# Altium schematic sheet I,O headers.SchDoc
size A4; SheetNumber: 4; SheetTotal: 4
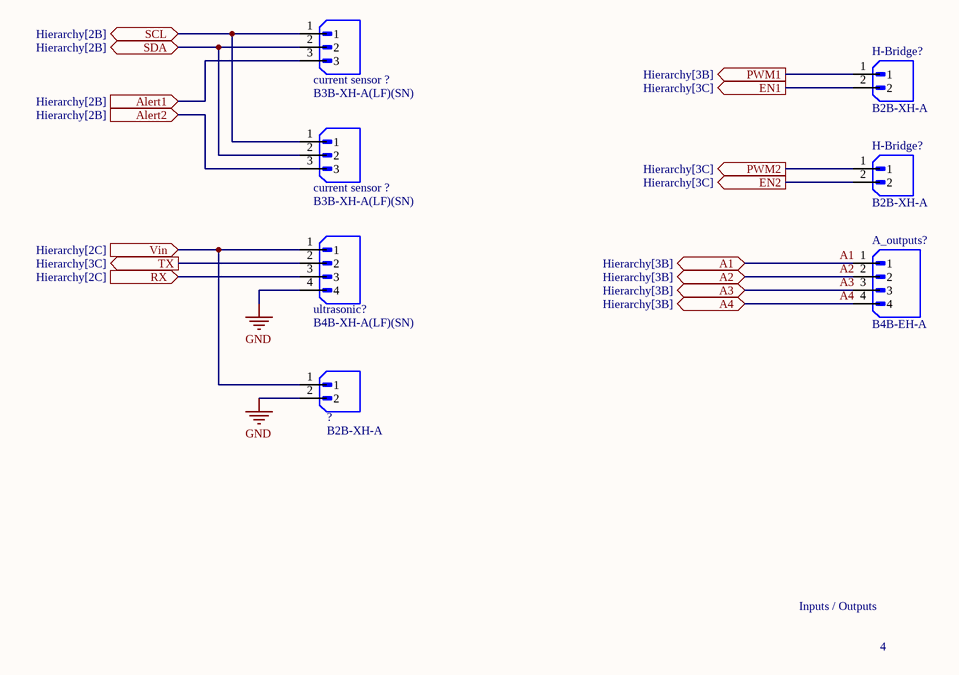
[diagram p0: I,O headers.SchDoc]

## Parts
(Parts that share a designator on the sheet are numbered #1, #2 ... from top to bottom, then left to right.)
?  B2B-XH-A  [JST_B2B-XH-A]
A_outputs?  B4B-EH-A  [JST_B4B-EH-A]
current_sensor_?#1  B3B-XH-A(LF)(SN)  [JST_B3B-XH-A(LF)(SN)]
current_sensor_?#2  B3B-XH-A(LF)(SN)  [JST_B3B-XH-A(LF)(SN)]
H-Bridge?#1  B2B-XH-A  [JST_B2B-XH-A]
H-Bridge?#2  B2B-XH-A  [JST_B2B-XH-A]
ultrasonic?  B4B-XH-A(LF)(SN)  [JST_B4B-XH-A(LF)(SN)]

## Ports
A1 (bidir, see Hierarchy[3B]), A2 (bidir, see Hierarchy[3B]), A3 (bidir, see Hierarchy[3B]), A4 (bidir, see Hierarchy[3B]), Alert1 (in, see Hierarchy[2B]), Alert2 (in, see Hierarchy[2B]), EN1 (out, see Hierarchy[3C]), EN2 (out, see Hierarchy[3C]), PWM1 (out, see Hierarchy[3B]), PWM2 (out, see Hierarchy[3C]), RX (in, see Hierarchy[2C]), SCL (bidir, see Hierarchy[2B]), SDA (bidir, see Hierarchy[2B]), TX (out, see Hierarchy[3C]), Vin (in, see Hierarchy[2C])

## Nets
GND: ?.2 ultrasonic?.4
A1: A_outputs?.1 ; port A1
A2: A_outputs?.2 ; port A2
A3: A_outputs?.3 ; port A3
A4: A_outputs?.4 ; port A4
Alert1: current_sensor_?#1.3 ; port Alert1
Alert2: current_sensor_?#2.3 ; port Alert2
EN1: H-Bridge?#1.2 ; port EN1
EN2: H-Bridge?#2.2 ; port EN2
PWM1: H-Bridge?#1.1 ; port PWM1
PWM2: H-Bridge?#2.1 ; port PWM2
RX: ultrasonic?.3 ; port RX
SCL: current_sensor_?#1.1 current_sensor_?#2.1 ; port SCL
SDA: current_sensor_?#1.2 current_sensor_?#2.2 ; port SDA
TX: ultrasonic?.2 ; port TX
Vin: ?.1 ultrasonic?.1 ; port Vin

## Notes on the sheet
- Inputs / Outputs
- 4

## Library data of the parts
? H-Bridge?#1 H-Bridge?#2 = B2B-XH-A: MF: {'manufacturer': u'JST Sales America Inc.'}; Package: None; Price: None; Value: *; MP: B2B-XH-A; Availability: Unavailable
A_outputs? = B4B-EH-A: Connector Header Through Hole 4 position 0.098 (2.50mm); MF: JST; SnapEDA_Link: https://www.snapeda.com/parts/B4B-EH-A/JST/view-part/?ref=snap; Package: None; Value: *; MP: B4B-EH-A; Check_prices: https://www.snapeda.com/parts/B4B-EH-A/JST/view-part/?ref=eda
current_sensor_?#1 current_sensor_?#2 = B3B-XH-A(LF)(SN): Connector Header Through Hole 3 position 0.098 (2.50mm); MF: JST Sales; SnapEDA_Link: https://www.snapeda.com/parts/B3B-XH-A(LF)(SN)/JST+Sales+America+Inc./view-part/?ref=snap; Package: None; Value: *; MP: B3B-XH-A(LF)(SN); Check_prices: https://www.snapeda.com/parts/B3B-XH-A(LF)(SN)/JST+Sales+America+Inc./view-part/?ref=eda
ultrasonic? = B4B-XH-A(LF)(SN): Connector Header Through Hole 4 position 0.098 (2.50mm); MF: JST Sales; SnapEDA_Link: https://www.snapeda.com/parts/B4B-XH-A(LF)(SN)/JST+Sales+America+Inc./view-part/?ref=snap; Package: None; Value: *; MP: B4B-XH-A(LF)(SN); Check_prices: https://www.snapeda.com/parts/B4B-XH-A(LF)(SN)/JST+Sales+America+Inc./view-part/?ref=eda